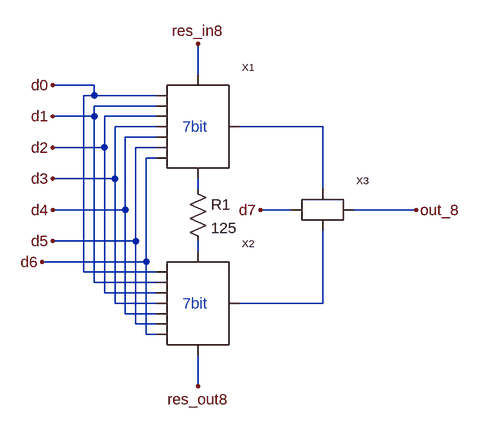
[diagram p0: schematic level7.asc]
level7.asc, the LTspice schematic file:
Version 4
SHEET 1 880 680
WIRE 160 32 160 -16
WIRE 0 48 -64 48
WIRE 0 64 0 48
WIRE 0 64 -16 64
WIRE 96 64 0 64
WIRE 96 80 0 80
WIRE 0 96 0 80
WIRE 0 96 -64 96
WIRE 96 96 16 96
WIRE 96 112 32 112
WIRE 352 112 224 112
WIRE 96 128 48 128
WIRE 16 144 16 96
WIRE 16 144 -64 144
WIRE 96 144 64 144
WIRE 96 160 80 160
WIRE 32 192 32 112
WIRE 32 192 -64 192
WIRE 160 208 160 192
WIRE 352 208 352 112
WIRE 48 240 48 128
WIRE 48 240 -64 240
WIRE 304 240 256 240
WIRE 496 240 400 240
WIRE 64 288 64 144
WIRE 64 288 -64 288
WIRE 160 304 160 288
WIRE 80 320 80 160
WIRE 80 320 -80 320
WIRE -16 336 -16 64
WIRE 96 336 -16 336
WIRE 0 352 0 96
WIRE 96 352 0 352
WIRE 16 368 16 144
WIRE 96 368 16 368
WIRE 32 384 32 192
WIRE 96 384 32 384
WIRE 352 384 352 272
WIRE 352 384 224 384
WIRE 48 400 48 240
WIRE 96 400 48 400
WIRE 64 416 64 288
WIRE 96 416 64 416
WIRE 80 432 80 320
WIRE 96 432 80 432
WIRE 160 512 160 464
FLAG -64 48 d0
FLAG -64 96 d1
FLAG -64 144 d2
FLAG -64 192 d3
FLAG -64 240 d4
FLAG -64 288 d5
FLAG -80 320 d6
FLAG 256 240 d7
FLAG 160 -16 res_in8
FLAG 496 240 out_8
FLAG 160 512 res_out8
SYMBOL level6 160 112 R0
SYMATTR InstName X1
SYMBOL level6 160 384 R0
SYMATTR InstName X2
SYMBOL switch 352 240 R0
SYMATTR InstName X3
SYMBOL res 144 192 R0
SYMATTR InstName R1
SYMATTR Value 125
TEXT 136 112 Left 2 ;7bit
TEXT 136 384 Left 2 ;7bit

The netlist it stands for:
* level7.asc
XX1 d0 d1 d2 d3 d4 d5 d6 res_in8 N002 N001 level6  ; pins d0 d1 d2 d3 d4 d5 d6 res_in7 res_out7 out_7
XX2 d0 d1 d2 d3 d4 d5 d6 N003 res_out8 N004 level6  ; pins d0 d1 d2 d3 d4 d5 d6 res_in7 res_out7 out_7
XX3 d7 N001 N004 out_8 switch  ; pins dig_in in_1 in_2 Vout
R1 N002 N003 125
* 7bit
* 7bit
.backanno
.end